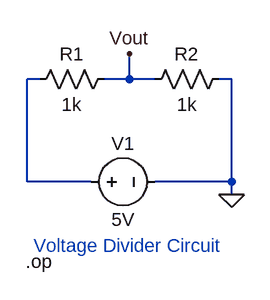
[diagram p0: schematic voltage_divider_circuit.asc]
voltage_divider_circuit.asc, the LTspice schematic file:
Version 4
SHEET 1 880 680
WIRE 80 96 64 96
WIRE 192 96 192 64
WIRE 192 96 160 96
WIRE 224 96 192 96
WIRE 320 96 304 96
WIRE 64 224 64 96
WIRE 144 224 64 224
WIRE 320 224 320 96
WIRE 320 224 224 224
WIRE 320 240 320 224
FLAG 320 240 0
FLAG 192 64 Vout
DATAFLAG 320 144 ""
DATAFLAG 192 80 ""
DATAFLAG 64 144 ""
SYMBOL res 176 80 R90
WINDOW 0 0 56 VBottom 2
WINDOW 3 32 56 VTop 2
SYMATTR InstName R1
SYMATTR Value 1k
SYMBOL res 320 80 R90
WINDOW 0 0 56 VBottom 2
WINDOW 3 32 56 VTop 2
SYMATTR InstName R2
SYMATTR Value 1k
SYMBOL voltage 128 224 R270
WINDOW 0 32 56 VTop 2
WINDOW 3 -32 56 VBottom 2
WINDOW 123 0 0 Left 0
WINDOW 39 0 0 Left 0
SYMATTR InstName V1
SYMATTR Value 5V
TEXT 72 304 Left 2 ;Voltage Divider Circuit
TEXT 62 324 Left 2 !.op

The netlist it stands for:
* voltage_divider_circuit.asc
R1 Vout N001 1k
R2 0 Vout 1k
V1 N001 0 5V
* Voltage Divider Circuit
.op
.backanno
.end